# Altium project DevKitWRM1470-r1.2.PrjPcb
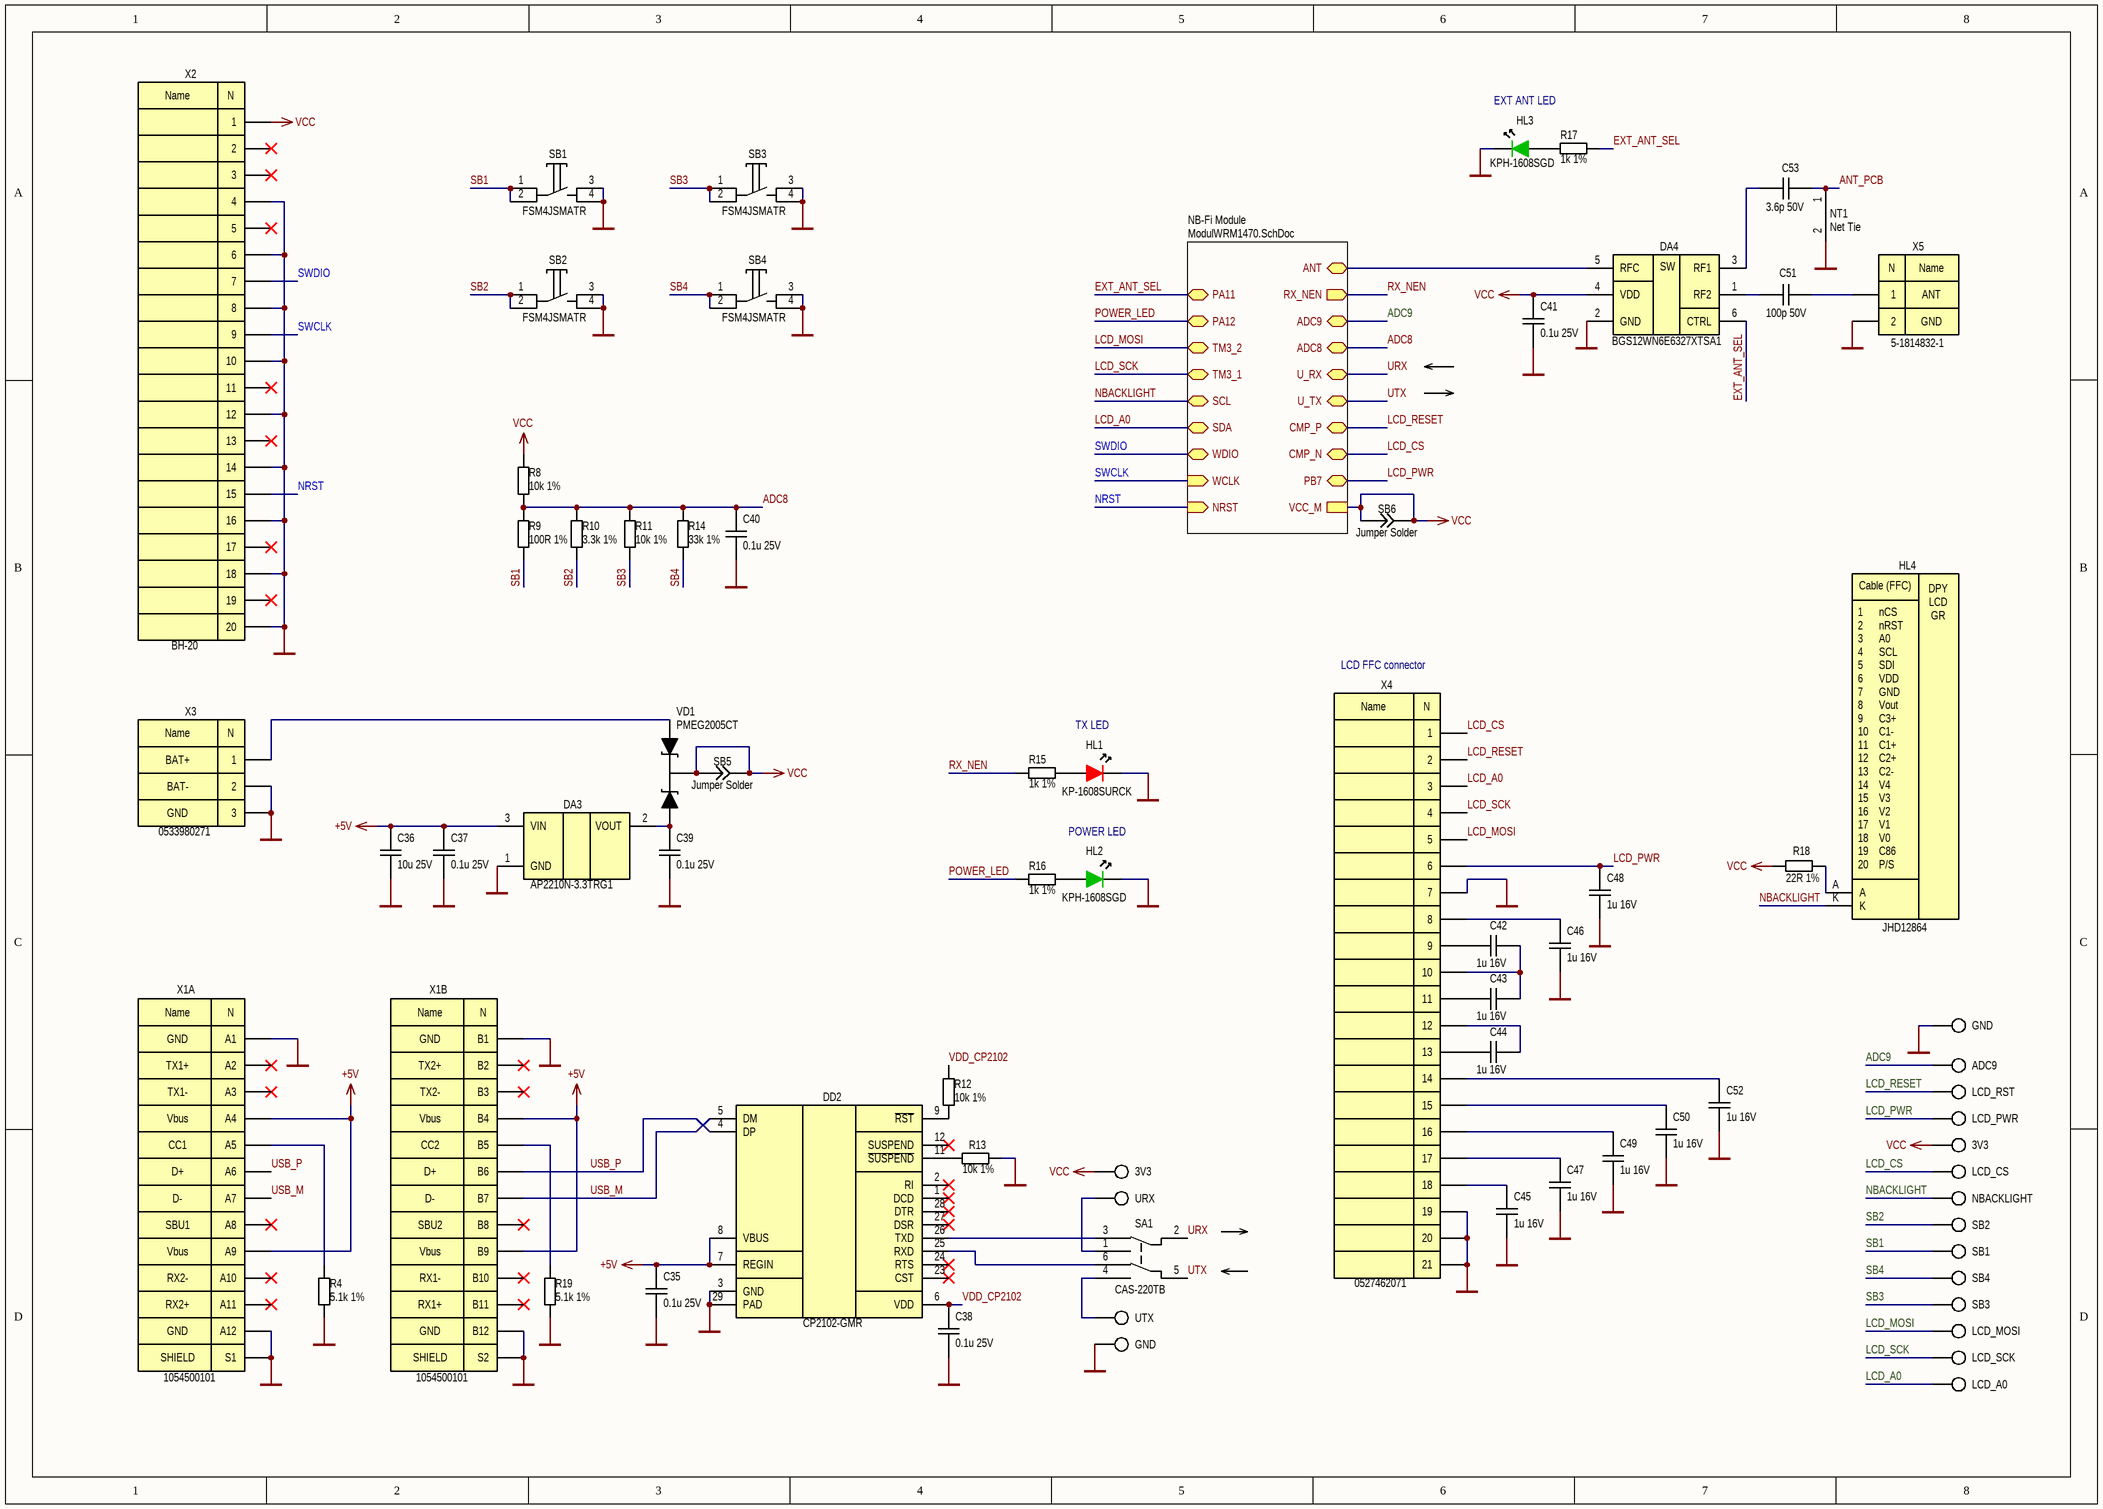
[diagram p0: DevKitWRM1470-r1.2.SchDoc]
2 sheets, 154 parts. Net scope: hierarchical (ports join the sheet entries above them; power ports are global).
Board file: DevKitWRM1470-r1.2.PcbDoc
Sheets:
  DevKitWRM1470-r1.2.SchDoc
    NB-Fi Module = ModulWRM1470.SchDoc

## Sheet DevKitWRM1470-r1.2.SchDoc
size A3; SheetNumber: 1; PageSetup: Record=PageOptions|CenterHorizontal=True|CenterVertical=True|PrintScale=0.52|XCorrection=1.00|YCorrection=1.00|PrintKind=1|BorderSize=5000000|LeftOffset=0|BottomOffset=0|Orientation=2|PaperLength=1000|PaperWidth=1000|Scale=100|PaperSource=7|PrintQuality=600|MediaType=1|DitherType=10|PaperKind=A4|PrintScaleMode=1

### Parts
C35  0.1u 25V  [C0402]
C36  10u 25V  [C0805]
C37  0.1u 25V  [C0402]
C38  0.1u 25V  [C0402]
C39  0.1u 25V  [C0402]
C40  0.1u 25V  [C0402]
C41  0.1u 25V  [C0402]
C42  1u 16V  [C0402]
C43  1u 16V  [C0402]
C44  1u 16V  [C0402]
C45  1u 16V  [C0402]
C46  1u 16V  [C0402]
C47  1u 16V  [C0402]
C48  1u 16V  [C0402]
C49  1u 16V  [C0402]
C50  1u 16V  [C0402]
C51  100p 50V  [C0402]
C52  1u 16V  [C0402]
C53  3.6p 50V  [C0402]
DA3  AP2210N-3.3TRG1  [SOT23-3L]
DA4  BGS12WN6E6327XTSA1  [6-XFDFN]
DD2  CP2102-GMR  [QFN28]
HL1  KP-1608SURCK  [LED0603_RED]
HL2  KPH-1608SGD  [LED0603_GREEN]
HL3  KPH-1608SGD  [LED0603_GREEN]
HL4  JHD12864  [JHD12864]
NT1  Net Tie  [NETTIE-5.0x4.0]  (net tie, no BOM)
R4  5.1k 1%  [R0402]
R8  10k 1%  [R0402]
R9  100R 1%  [R0402]
R10  3.3k 1%  [R0402]
R11  10k 1%  [R0402]
R12  10k 1%  [R0402]
R13  10k 1%  [R0402]
R14  33k 1%  [R0402]
R15  1k 1%  [R0402]
R16  1k 1%  [R0402]
R17  1k 1%  [R0402]
R18  22R 1%  [R0402]
R19  5.1k 1%  [R0402]
SA1  CAS-220TB  [CAS-220]
SB1  FSM4JSMATR  [FSM4JSMATR]
SB2  FSM4JSMATR  [FSM4JSMATR]
SB3  FSM4JSMATR  [FSM4JSMATR]
SB4  FSM4JSMATR  [FSM4JSMATR]
SB5  Jumper Solder  [SB0805]  (no BOM)
SB6  Jumper Solder  [SB0805]  (no BOM)
VD1  PMEG2005CT  [SOT23-3L]
X1  1054500101  [1054500101]  (parts A,B of 2)
X2  BH-20  [BH-20_PCB]
X3  0533980271  [0533980271_PCB]
X4  0527462071  [0527462071_PCB]
X5  5-1814832-1  [5-1814832-1]
XT24  3V3  [PAD-d0.9-x1.5-y1.5]  (no BOM)
XT25  URX  [PAD-d0.9-x1.5-y1.5]  (no BOM)
XT26  UTX  [PAD-d0.9-x1.5-y1.5]  (no BOM)
XT27  GND  [PAD-d0.9-x1.5-y1.5]  (no BOM)
XT28  GND  [PAD-d0.9-x1.5-y1.5]  (no BOM)
XT29  ADC9  [PAD-d0.9-x1.5-y1.5]  (no BOM)
XT30  LCD_RST  [PAD-d0.9-x1.5-y1.5]  (no BOM)
XT31  LCD_PWR  [PAD-d0.9-x1.5-y1.5]  (no BOM)
XT32  3V3  [PAD-d0.9-x1.5-y1.5]  (no BOM)
XT33  LCD_CS  [PAD-d0.9-x1.5-y1.5]  (no BOM)
XT34  NBACKLIGHT  [PAD-d0.9-x1.5-y1.5]  (no BOM)
XT35  SB2  [PAD-d0.9-x1.5-y1.5]  (no BOM)
XT36  SB1  [PAD-d0.9-x1.5-y1.5]  (no BOM)
XT37  SB4  [PAD-d0.9-x1.5-y1.5]  (no BOM)
XT38  SB3  [PAD-d0.9-x1.5-y1.5]  (no BOM)
XT39  LCD_MOSI  [PAD-d0.9-x1.5-y1.5]  (no BOM)
XT40  LCD_SCK  [PAD-d0.9-x1.5-y1.5]  (no BOM)
XT41  LCD_A0  [PAD-d0.9-x1.5-y1.5]  (no BOM)

### Sub-sheets
NB-Fi Module = ModulWRM1470.SchDoc: ADC8 (bidir), TM3_2 (bidir), ADC9 (bidir), TM3_1 (bidir), SCL (bidir), SDA (bidir), WDIO (bidir), WCLK (in), NRST (in), U_RX (bidir), U_TX (bidir), CMP_P (bidir), CMP_N (bidir), ANT (bidir), PA12 (bidir), PB7 (bidir), VCC_M, PA11 (bidir), RX_NEN (out)

### Nets
+5V: C35.2 C36.1 C37.2 DA3.3(VIN) DD2.7(REGIN) DD2.8(VBUS) X1.A4 X1.A9 X1.B4 X1.B9
GND: C35.1 C36.2 C37.1 C38.1 C39.1 C40.1 C41.1 C45.1 C46.1 C47.1 C48.1 C49.1 C50.1 C52.1 DA3.1(GND) DA4.2(GND) DD2.3(GND) DD2.29(PAD) HL1.2 HL2.2 HL3.2 NT1.2 R4.2 R13.1 R19.2 SB1.3 SB1.4 SB2.3 SB2.4 SB3.3 SB3.4 SB4.3 SB4.4 X1.A1 X1.A12 X1.B1 X1.B12 X1.S1 X1.S2 X2.4 X2.6 X2.8 X2.10 X2.12 X2.14 X2.16 X2.18 X2.20 X3.2 X3.3 X4.7 X4.19 X4.20 X4.21 X5.2 XT27.1 XT28.1
VCC: C41.2 DA4.4(VDD) R8.2 R18.2 SB5.1 SB5.2 SB6.1 SB6.2 VD1.3(K) X2.1 XT24.1 XT32.1 ; sheet NB-Fi Module/VCC_M  [project net VCC_M]
ADC8: C40.2 R8.1 R9.2 R10.2 R11.2 R14.2 ; sheet NB-Fi Module/ADC8
ADC9: XT29.1 ; sheet NB-Fi Module/ADC9
ANT_PCB: C53.2 NT1.1
EXT_ANT_SEL: DA4.6(CTRL) R17.1 ; sheet NB-Fi Module/PA11
LCD_A0: X4.3 XT41.1 ; sheet NB-Fi Module/SDA  [project net I2C1_SDA]
LCD_CS: X4.1 XT33.1 ; sheet NB-Fi Module/CMP_N  [project net COMP1_INM]
LCD_MOSI: X4.5 XT39.1 ; sheet NB-Fi Module/TM3_2
LCD_PWR: C48.2 X4.6 XT31.1 ; sheet NB-Fi Module/PB7
LCD_RESET: X4.2 XT30.1 ; sheet NB-Fi Module/CMP_P  [project net COMP1_INP]
LCD_SCK: X4.4 XT40.1 ; sheet NB-Fi Module/TM3_1
NBACKLIGHT: HL4.K XT34.1 ; sheet NB-Fi Module/SCL  [project net I2C1_SCL]
NRST: X2.15 ; sheet NB-Fi Module/NRST
POWER_LED: R16.1 ; sheet NB-Fi Module/PA12  [project net PA12]
RX_NEN: R15.1 ; sheet NB-Fi Module/RX_NEN
SB1: R9.1 SB1.1 SB1.2 XT36.1
SB2: R10.1 SB2.1 SB2.2 XT35.1
SB3: R11.1 SB3.1 SB3.2 XT38.1
SB4: R14.1 SB4.1 SB4.2 XT37.1
SWCLK: X2.9 ; sheet NB-Fi Module/WCLK
SWDIO: X2.7 ; sheet NB-Fi Module/WDIO
URX: SA1.2 ; sheet NB-Fi Module/U_RX  [project net LPUART1_RX]
USB_M: DD2.5(DM) X1.A7 X1.B7
USB_P: DD2.4(DP) X1.A6 X1.B6
UTX: SA1.5 ; sheet NB-Fi Module/U_TX  [project net LPUART1_TX]
VDD_CP2102: C38.2 DD2.6(VDD) R12.2
NetC33_2: DA4.5(RFC) ; sheet NB-Fi Module/ANT
NetC39_2: C39.2 DA3.2(VOUT) VD1.2(A2)
NetC42_1: C42.1 C43.1 X4.10
NetC42_2: C42.2 X4.9
NetC43_2: C43.2 X4.11
NetC44_1: C44.1 X4.12
NetC44_2: C44.2 X4.13
NetC45_2: C45.2 X4.18
NetC46_2: C46.2 X4.8
NetC47_2: C47.2 X4.17
NetC49_2: C49.2 X4.16
NetC50_2: C50.2 X4.15
NetC51_1: C51.1 DA4.1(RF2)
NetC51_2: C51.2 X5.1
NetC52_2: C52.2 X4.14
NetC53_1: C53.1 DA4.3(RF1)
NetDD2_9: DD2.9(~{RST}) R12.1
NetDD2_11: DD2.11(~{SUSPEND}) R13.2
NetDD2_25: DD2.25(RXD) SA1.6
NetDD2_26: DD2.26(TXD) SA1.3
NetHL1_1: HL1.1 R15.2
NetHL2_1: HL2.1 R16.2
NetHL3_1: HL3.1 R17.2
NetHL4_A: HL4.A R18.1
NetR4_1: R4.1 X1.A5
NetR19_1: R19.1 X1.B5
NetSA1_1: SA1.1 XT25.1
NetSA1_4: SA1.4 XT26.1
NetVD1_1: VD1.1(A1) X3.1

Not connected (* = marked no-connect by the designer): DD2 1(DCD)* 2(RI)* 12(SUSPEND)* 23(CST)* 24(RTS)* 27(DSR)* 28(DTR)*; X1 A2* A3* A8* A10* A11* B2* B3* B8* B10* B11*; X2 2* 3* 5* 11* 13* 17* 19*

### Notes on the sheet
- EXT ANT LED
- LCD FFC connector
- BAT+
- BAT-
- TX LED
- GND
- POWER LED
- (in symbol 5-1814832-1) N; Name; ANT; GND
- (in symbol 0527462071) Name; N
- (in symbol 0533980271) Name; N
- (in symbol 1054500101, part A) Name; N; GND; TX1+; TX1-; Vbus; CC1; D+; D-; SBU1; RX2-; RX2+; SHIELD
- (in symbol 1054500101, part B) Name; N; GND; TX2+; TX2-; Vbus; CC2; D+; D-; SBU2; RX1-; RX1+; SHIELD
- (in symbol BGS12WN6E6327XTSA1) SW
- (in symbol BH-20) Name; N
- (in symbol JHD12864) Cable (FFC); 1; nCS; DPY / LCD / GR; 2; nRST; 3; A0; 4; SCL; 5; SDI; 6; VDD; 7; GND; 8; Vout; 9; C3+; 10; C1-; 11; C1+; 12; C2+; 13; C2-; 14; V4; 15; V3; 16; V2; 17; V1; 18; V0; 19; C86; 20; P/S

### Library data of the parts
C35 C37-C41 = CC0402KRX7R8BB104: CAP CER 0.1UF 25V X7R 0402; PartNumber: CC0402KRX7R8BB104
C36 = CL21A106KAFN3NE: CAP CER 10UF 25V X5R 0805; PartNumber: CL21A106KAFN3NE
C42-C50 C52 = CC0402KRX5R7BB105: CAP CER 1UF 16V X5R 0402; PartNumber: CC0402KRX5R7BB105
C51 = CC0402JRNPO9BN101: CAP CER 100PF 50V C0G/NPO 0402; PartNumber: CC0402JRNPO9BN101
C53 = CC0402BRNPO9BN3R6: CAP CER 3.6PF 50V NPO 0402; PartNumber: CC0402BRNPO9BN3R6
DA3 = AP2210N-3.3TRG1: IC REG LINEAR 3.3V 300MA SOT23-3; PartNumber: AP2210N-3.3TRG1
DA4 = BGS12WN6E6327XTSA1: RF Switch IC WLAN SPDT 50Ohm PG-TSNP-6-10; PartNumber: BGS12WN6E6327XTSA1
DD2 = CP2102-GMR: IC USB-TO-UART BRIDGE 28VQFN; PartNumber: CP2102-GMR
HL1 = KP-1608SURCK: LED Red 0603 1.95V Forward voltage typ.; PartNumber: KP-1608SURCK
HL2 HL3 = KPH-1608SGD: Led Green 0603 2.2V Forward voltage typ.; PartNumber: KPH-1608SGD
HL4 = JHD12864: Display Graphical with LED-backlight; PartNumber: JHD12864
NT1 = NT-1: PCB Net Tie
R4 R19 = RC0402FR-075K1L: RES SMD 5.1K OHM 1% 1/16W 0402; PartNumber: RC0402FR-075K1L
R8 R11-R13 = RC0402FR-0710KL: RES SMD 10K OHM 1% 1/16W 0402; PartNumber: RC0402FR-0710KL
R9 = RC0402FR-07100RL: RES SMD 100 OHM 1% 1/16W 0402; PartNumber: RC0402FR-07100RL
R10 = RC0402FR-073K3L: RES SMD 3.3K OHM 1% 1/16W 0402; PartNumber: RC0402FR-073K3L
R14 = RC0402FR-0733KL: RES SMD 33K OHM 1% 1/16W 0402; PartNumber: RC0402FR-0733KL
R15-R17 = RC0402FR-071KL: RES SMD 1K OHM 1% 1/16W 0402; PartNumber: RC0402FR-071KL
R18 = RC0402FR-0722RL: RES SMD 22 OHM 1% 1/16W 0402; PartNumber: RC0402FR-0722RL
SA1 = CAS-220TB: SWITCH SLIDE DPDT 100MA 6V; PartNumber: CAS-220TB
SB1-SB4 = FSM4JSMATR: SWITCH TACTILE SPST-NO 0.05A 24V; PartNumber: FSM4JSMATR
SB5 SB6 = JS_0805: Jumper Solder 0805; Value: *
VD1 = PMEG2005CT: DIODE ARRAY SCHOTTKY 20V SOT23; PartNumber: PMEG2005CT
X1 = 1054500101: CONN RCP USB3.1 TYPEC 24P SMD RA; PartNumber: 1054500101; ComponentLink1Description: Datasheet; ComponentLink1URL: https://www.molex.com/pdm_docs/ps/PS-105448-001.pdf; ComponentLink2Description: Drawing; ComponentLink2URL: https://www.molex.com/pdm_docs/sd/1054500101_sd.pdf
X2 = BH-20: CONN MALE 20POS 2.54 (IDC-20MS); PartNumber: BH-20
X3 = 0533980271: CONN HEADER SMD 2POS 1.25MM; PartNumber: 0533980271
X4 = 0527462071: CONN FFC BOTTOM 20POS 0.50MM R/A; PartNumber: 0527462071
X5 = 5-1814832-1: CONN SMA JACK STR 50 OHM PCB; PartNumber: 5-1814832-1
XT24-XT41 = PIN

## Sheet ModulWRM1470.SchDoc: Радиомодуль NB-Fi
size 420 x 297 mm; CompanyName: Телематические решения; Address1: Address1; Address2: Address2; Address3: Address3; Address4: Address4; DocumentNumber: XXXX.012345.007Э3; SheetNumber: 1; SheetTotal: 1; Scale: 1:1; Title2str: WRM1470-r1.0; DocumentType: Схема электрическая принципиальная; FirstReferrence: АБВГ.123456.001
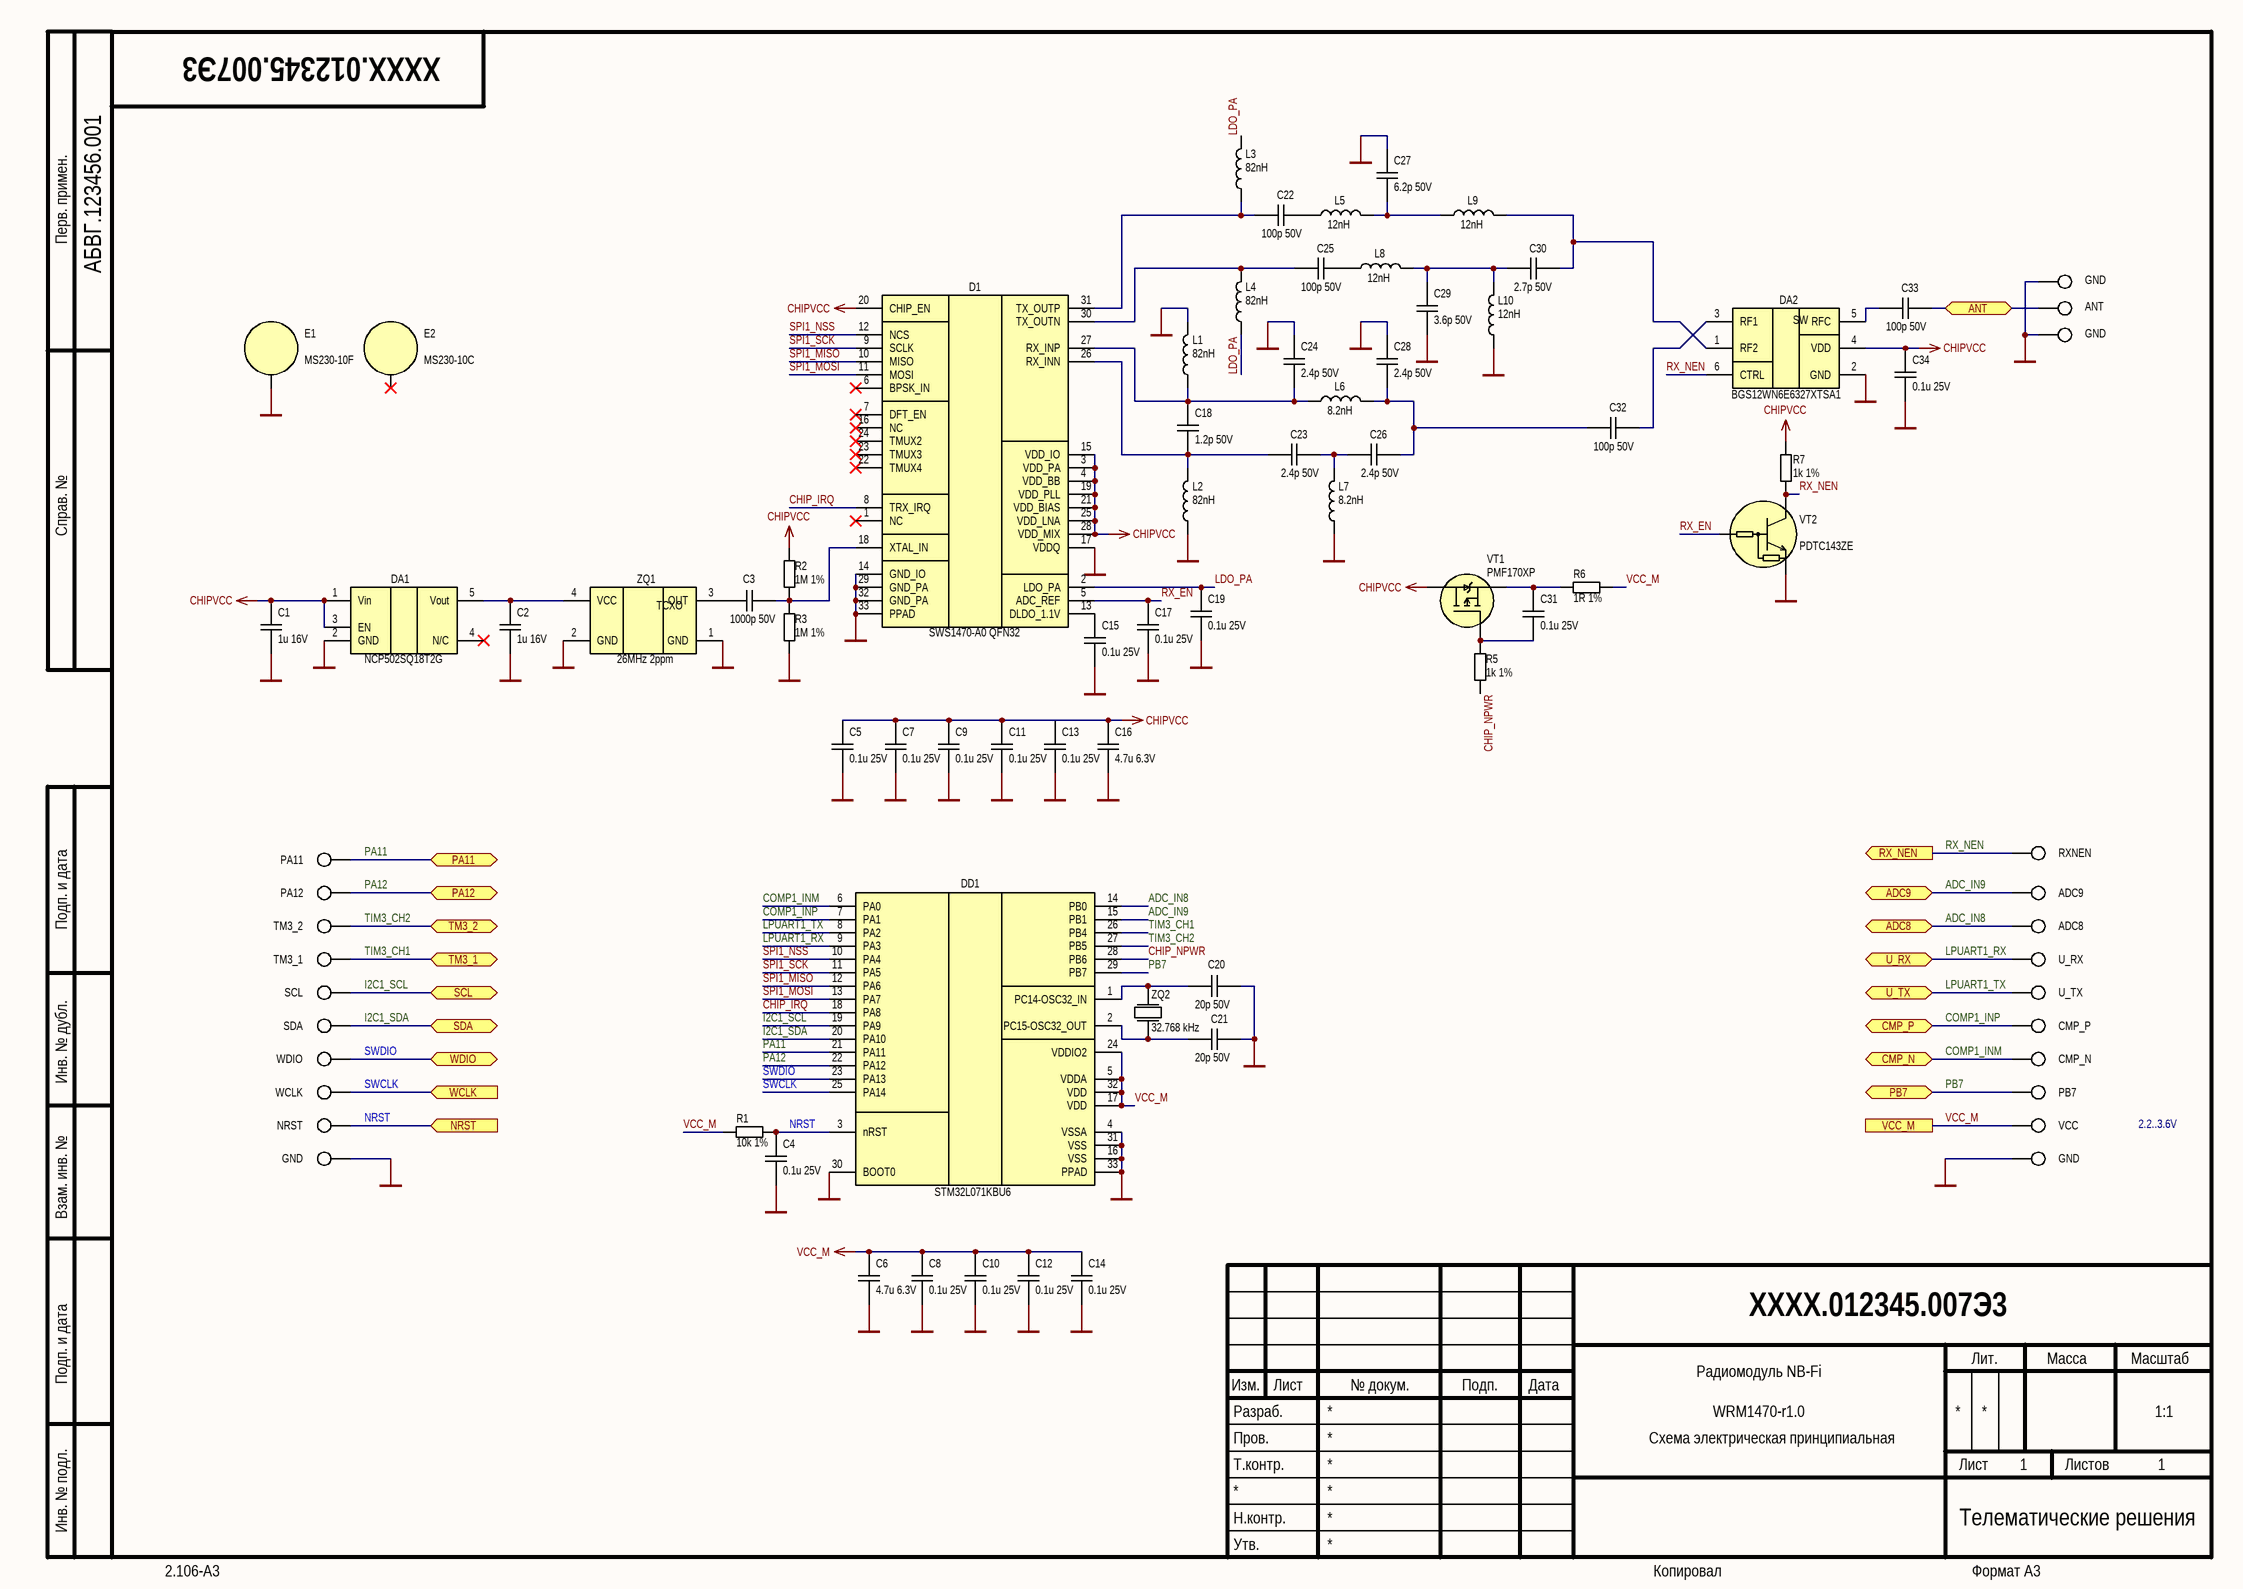
[diagram p1: ModulWRM1470.SchDoc]

### Parts
C1  1u 16V  [C0402]
C2  1u 16V  [C0402]
C3  1000p 50V  [C0402]
C4  0.1u 25V  [C0402]
C5  0.1u 25V  [C0402]
C6  4.7u 6.3V  [C0402]
C7  0.1u 25V  [C0402]
C8  0.1u 25V  [C0402]
C9  0.1u 25V  [C0402]
C10  0.1u 25V  [C0402]
C11  0.1u 25V  [C0402]
C12  0.1u 25V  [C0402]
C13  0.1u 25V  [C0402]
C14  0.1u 25V  [C0402]
C15  0.1u 25V  [C0402]
C16  4.7u 6.3V  [C0402]
C17  0.1u 25V  [C0402]
C18  1.2p 50V  [C0402]
C19  0.1u 25V  [C0402]
C20  20p 50V  [C0402]
C21  20p 50V  [C0402]
C22  100p 50V  [C0402]
C23  2.4p 50V  [C0402]
C24  2.4p 50V  [C0402]
C25  100p 50V  [C0402]
C26  2.4p 50V  [C0402]
C27  6.2p 50V  [C0402]
C28  2.4p 50V  [C0402]
C29  3.6p 50V  [C0402]
C30  2.7p 50V  [C0402]
C31  0.1u 25V  [C0402]
C32  100p 50V  [C0402]
C33  100p 50V  [C0402]
C34  0.1u 25V  [C0402]
D1  SWS1470-A0 QFN32  [QFN32]
DA1  NCP502SQ18T2G  [SOT323-5]
DA2  BGS12WN6E6327XTSA1  [6-XFDFN]
DD1  STM32L071KBU6  [UFQFPN32]
E1  MS230-10F  [MS230-10F]
E2  MS230-10C  [MS230-10C]
L1  82nH  [L0402_LQW]
L2  82nH  [L0402_LQW]
L3  82nH  [L0402_LQW]
L4  82nH  [L0402_LQW]
L5  12nH  [L0402_LQW]
L6  8.2nH  [L0402_LQW]
L7  8.2nH  [L0402_LQW]
L8  12nH  [L0402_LQW]
L9  12nH  [L0402_LQW]
L10  12nH  [L0402_LQW]
R1  10k 1%  [R0402]
R2  1M 1%  [R0402]
R3  1M 1%  [R0402]
R5  1k 1%  [R0402]
R6  1R 1%  [R0402]
R7  1k 1%  [R0402]
VT1  PMF170XP  [SOT323]
VT2  PDTC143ZE  [SOT416]
XT1  PA11  [PAD-d0.6-x1.1-y1.2]  (no BOM)
XT2  PA12  [PAD-d0.6-x1.1-y1.2]  (no BOM)
XT3  TM3_2  [PAD-d0.6-x1.1-y1.2]  (no BOM)
XT4  TM3_1  [PAD-d0.6-x1.1-y1.2]  (no BOM)
XT5  SCL  [PAD-d0.6-x1.1-y1.2]  (no BOM)
XT6  SDA  [PAD-d0.6-x1.1-y1.2]  (no BOM)
XT7  WDIO  [PAD-d0.6-x1.1-y1.2]  (no BOM)
XT8  WCLK  [PAD-d0.6-x1.1-y1.2]  (no BOM)
XT9  NRST  [PAD-d0.6-x1.1-y1.2]  (no BOM)
XT10  GND  [PAD-d0.6-x1.1-y1.2]  (no BOM)
XT11  GND  [PAD-d0.6-x1.1-y1.2]  (no BOM)
XT12  VCC  [PAD-d0.6-x1.1-y1.2]  (no BOM)
XT13  PB7  [PAD-d0.6-x1.1-y1.2]  (no BOM)
XT14  CMP_N  [PAD-d0.6-x1.1-y1.2]  (no BOM)
XT15  CMP_P  [PAD-d0.6-x1.1-y1.2]  (no BOM)
XT16  U_TX  [PAD-d0.6-x1.1-y1.2]  (no BOM)
XT17  U_RX  [PAD-d0.6-x1.1-y1.2]  (no BOM)
XT18  ADC8  [PAD-d0.6-x1.1-y1.2]  (no BOM)
XT19  ADC9  [PAD-d0.6-x1.1-y1.2]  (no BOM)
XT20  RXNEN  [PAD-d0.6-x1.1-y1.2]  (no BOM)
XT21  GND  [PAD-d0.6-x1.1-y1.2]  (no BOM)
XT22  ANT  [PAD-d0.6-x1.1-y1.2]  (no BOM)
XT23  GND  [PAD-d0.6-x1.1-y1.2]  (no BOM)
ZQ1  26MHz 2ppm  [QSMD2.0x1.6x0.7]
ZQ2  32.768 kHz  [QSMD3.2X1.5X0.8]

### Ports
ADC8 (bidir), ADC9 (bidir), ANT (bidir), CMP_N (bidir), CMP_P (bidir), NRST (in), PA11 (bidir), PA12 (bidir), PB7 (bidir), RX_NEN (out), SCL (bidir), SDA (bidir), TM3_1 (bidir), TM3_2 (bidir), U_RX (bidir), U_TX (bidir), VCC_M, WCLK (in), WDIO (bidir)

### Nets
CHIPVCC: C1.2 C5.2 C7.2 C9.2 C11.2 C13.2 C16.2 C34.2 D1.3(VDD_PA) D1.4(VDD_BB) D1.15(VDD_IO) D1.19(VDD_PLL) D1.20(CHIP_EN) D1.21(VDD_BIAS) D1.25(VDD_LNA) D1.28(VDD_MIX) DA1.1(Vin) DA1.3(EN) DA2.4(VDD) R2.2 R7.2 VT1.3(D)
GND: C1.1 C2.1 C4.2 C5.1 C6.2 C7.1 C8.2 C9.1 C10.2 C11.1 C12.2 C13.1 C14.2 C15.1 C16.1 C17.1 C19.1 C20.2 C21.2 C24.1 C27.1 C28.1 C29.2 C34.1 D1.14(GND_IO) D1.17(VDDQ) D1.29(GND_PA) D1.32(GND_PA) D1.33(PPAD) DA1.2(GND) DA2.2(GND) DD1.4(VSSA) DD1.16(VSS) DD1.30(BOOT0) DD1.31(VSS) DD1.33(PPAD) E1.1(SHIELD) L1.2 L2.1 L7.1 L10.1 R3.1 VT2.2 XT10.1 XT11.1 XT21.1 XT23.1 ZQ1.1(GND) ZQ1.2(GND)
VCC_M: C6.1 C8.1 C10.1 C12.1 C14.1 DD1.5(VDDA) DD1.17(VDD) DD1.24(VDDIO2) DD1.32(VDD) R1.1 R6.1 XT12.1 ; port VCC_M
ADC_IN8: DD1.14(PB0) XT18.1 ; port ADC8  [project net ADC8]
ADC_IN9: DD1.15(PB1) XT19.1 ; port ADC9  [project net ADC9]
CHIP_IRQ: D1.8(TRX_IRQ) DD1.18(PA8)
CHIP_NPWR: DD1.28(PB6) R5.1
COMP1_INM: DD1.6(PA0) XT14.1 ; port CMP_N
COMP1_INP: DD1.7(PA1) XT15.1 ; port CMP_P
I2C1_SCL: DD1.19(PA9) XT5.1 ; port SCL
I2C1_SDA: DD1.20(PA10) XT6.1 ; port SDA
LDO_PA: C19.2 D1.2(LDO_PA) L3.2 L4.1
LPUART1_RX: DD1.9(PA3) XT17.1 ; port U_RX
LPUART1_TX: DD1.8(PA2) XT16.1 ; port U_TX
NRST: C4.1 DD1.3(nRST) R1.2 XT9.1 ; port NRST
PA11: DD1.21(PA11) XT1.1 ; port PA11  [project net EXT_ANT_SEL]
PA12: DD1.22(PA12) XT2.1 ; port PA12
PB7: DD1.29(PB7) XT13.1 ; port PB7  [project net LCD_PWR]
RX_EN: C17.2 D1.5(ADC_REF) VT2.1
RX_NEN: DA2.6(CTRL) R7.1 VT2.3 XT20.1 ; port RX_NEN
SPI1_MISO: D1.10(MISO) DD1.12(PA6)
SPI1_MOSI: D1.11(MOSI) DD1.13(PA7)
SPI1_NSS: D1.12(NCS) DD1.10(PA4)
SPI1_SCK: D1.9(SCLK) DD1.11(PA5)
SWCLK: DD1.25(PA14) XT8.1 ; port WCLK
SWDIO: DD1.23(PA13) XT7.1 ; port WDIO
TIM3_CH1: DD1.26(PB4) XT4.1 ; port TM3_1  [project net LCD_SCK]
TIM3_CH2: DD1.27(PB5) XT3.1 ; port TM3_2  [project net LCD_MOSI]
NetC2_2: C2.2 DA1.5(Vout) ZQ1.4(VCC)
NetC3_1: C3.1 ZQ1.3(OUT)
NetC3_2: C3.2 D1.18(XTAL_IN) R2.1 R3.2
NetC15_2: C15.2 D1.13(DLDO_1.1V)
NetC18_1: C18.1 C24.2 D1.27(RX_INP) L1.1 L6.1
NetC18_2: C18.2 C23.1 D1.26(RX_INN) L2.2
NetC20_1: C20.1 DD1.1(PC14-OSC32_IN) ZQ2.1
NetC21_1: C21.1 DD1.2(PC15-OSC32_OUT) ZQ2.3
NetC22_1: C22.1 D1.31(TX_OUTP) L3.1
NetC22_2: C22.2 L5.1
NetC23_2: C23.2 C26.1 L7.2
NetC25_1: C25.1 D1.30(TX_OUTN) L4.2
NetC25_2: C25.2 L8.1
NetC26_2: C26.2 C28.2 C32.1 L6.2
NetC27_2: C27.2 L5.2 L9.1
NetC29_1: C29.1 C30.1 L8.2 L10.2
NetC30_2: C30.2 DA2.1(RF2) L9.2
NetC31_1: C31.1 R5.2 VT1.1(G)
NetC31_2: C31.2 R6.2 VT1.2(S)
NetC32_2: C32.2 DA2.3(RF1)
NetC33_1: C33.1 DA2.5(RFC)
NetC33_2: C33.2 XT22.1 ; port ANT

Not connected (* = marked no-connect by the designer): D1 1(NC)* 6(BPSK_IN)* 7(DFT_EN)* 16(NC)* 22(TMUX4)* 23(TMUX3)* 24(TMUX2)*; DA1 4(N/C)*; E2 1(SHIELD)*

### Notes on the sheet
- 2.2..3.6V
- Перв. примен.
- Справ. №
- Подп. и дата
- Инв. № дубл.
- Взам. инв. №
- Разраб.
- Изм.
- Лист
- № докум.
- Подп.
- Дата
- Лит.
- Масса
- Масштаб
- Пров.
- Т.контр.
- Листов
- Инв. № подл.
- Утв.
- Н.контр.
- 2.106-A3
- Копировал
- Формат А3
- (in symbol BGS12WN6E6327XTSA1) SW
- (in symbol NT2016SA-26.000000MHZ-NBG2) TCXO

### Library data of the parts
C1 C2 = CC0402KRX5R7BB105: CAP CER 1UF 16V X5R 0402; PartNumber: CC0402KRX5R7BB105
C3 = CC0402JRX7R9BB102: CAP CER 1000PF 50V X7R 0402; PartNumber: CC0402JRX7R9BB102
C4 C5 C7-C15 C17 C19 C31 C34 = CC0402KRX7R8BB104: CAP CER 0.1UF 25V X7R 0402; PartNumber: CC0402KRX7R8BB104
C6 C16 = CC0402KRX5R5BB475: CAP CER 4.7UF 6.3V X5R 0402; PartNumber: CC0402KRX5R5BB475
C18 = CC0402BRNPO9BN1R2: CAP CER 1.2PF 50V C0G/NPO 0402; PartNumber: CC0402BRNPO9BN1R2
C20 C21 = CC0402JRNPO9BN200: CAP CER 20PF 50V C0G/NPO 0402; PartNumber: CC0402JRNPO9BN200
C22 C25 C32 C33 = CC0402JRNPO9BN101: CAP CER 100PF 50V C0G/NPO 0402; PartNumber: CC0402JRNPO9BN101
C23 C24 C26 C28 = CC0402BRNPO9BN2R4: CAP CER 2.4PF 50V NPO 0402; PartNumber: CC0402BRNPO9BN2R4
C27 = CC0402CRNPO9BN6R2: CAP CER 6.2PF 50V NPO 0402; PartNumber: CC0402CRNPO9BN6R2
C29 = CC0402BRNPO9BN3R6: CAP CER 3.6PF 50V NPO 0402; PartNumber: CC0402BRNPO9BN3R6
C30 = CC0402BRNPO9BN2R7: CAP CER 2.7PF 50V C0G/NPO 0402; PartNumber: CC0402BRNPO9BN2R7
D1 = SWS1470-A0 QFN32: Waviot NB-Fi RF Transceiver QFN32; PartNumber: SWS1470-A0 QFN32
DA1 = NCP502SQ18T2G: IC REG LINEAR 1.8V 80MA SC88A; PartNumber: NCP502SQ18T2G
DA2 = BGS12WN6E6327XTSA1: as DA4 on sheet DevKitWRM1470-r1.2; PartNumber: BGS12WN6E6327XTSA1
DD1 = STM32L071KBU6: ARM® Cortex®-M0+ STM32L0 Microcontroller IC 32-Bit 32MHz 128KB (128K x 8) FLASH 32-UFQFPN (5x5); PartNumber: STM32L071KBU6
E1 = MS230-10F: RF SHLD FRAME 0.461"X0.906" SLDR; PartNumber: MS230-10F
E2 = MS230-10C: RF SHIELD 0.461"X0.906" SNAP FIT; PartNumber: MS230-10C
L1-L4 = LQW15AN82NG00D: FIXED IND 82NH 130MA 2.24 OHM; PartNumber: LQW15AN82NG00D
L5 L8-L10 = LQW15AN12NG00D: FIXED IND 12NH 500MA 140 MOHM; PartNumber: LQW15AN12NG00D
L6 L7 = LQW15AN8N2G00D: FIXED IND 8.2NH 540MA 140 MOHM; PartNumber: LQW15AN8N2G00D
R1 = RC0402FR-0710KL: RES SMD 10K OHM 1% 1/16W 0402; PartNumber: RC0402FR-0710KL
R2 R3 = RC0402FR-071ML: RES SMD 1M OHM 1% 1/16W 0402; PartNumber: RC0402FR-071ML
R5 R7 = RC0402FR-071KL: RES SMD 1K OHM 1% 1/16W 0402; PartNumber: RC0402FR-071KL
R6 = RC0402FR-071RL: RES SMD 1 OHM 1% 1/16W 0402; PartNumber: RC0402FR-071RL
VT1 = PMF170XP: MOSFET P-CH 20V 1A SOT323; PartNumber: PMF170XP
VT2 = PDTC143ZE: SMALL SIGNAL BIPOLAR TRANSISTOR; PartNumber: PDTC143ZE
XT1-XT23 = PIN
ZQ1 = NT2016SA-26.000000MHZ-NBG2: TCXO Oscillator 4-pin; PartNumber: NT2016SA-26.000000MHZ-NBG2
ZQ2 = NX3215SA-32.768K-EXS00A: CRYSTAL 32.768KHZ 12.5PF SMD; PartNumber: NX3215SA-32.768K-EXS00A

## Nets that join several sheets
GND: DevKitWRM1470-r1.2 (57 pins), ModulWRM1470 (49 pins)
VCC_M: DevKitWRM1470-r1.2 (12 pins), ModulWRM1470 (12 pins)
ADC8: DevKitWRM1470-r1.2 (6 pins), ModulWRM1470 (DD1.14 XT18.1)
ADC9: DevKitWRM1470-r1.2 (XT29.1), ModulWRM1470 (DD1.15 XT19.1)
COMP1_INM: DevKitWRM1470-r1.2 (X4.1 XT33.1), ModulWRM1470 (DD1.6 XT14.1)
COMP1_INP: DevKitWRM1470-r1.2 (X4.2 XT30.1), ModulWRM1470 (DD1.7 XT15.1)
EXT_ANT_SEL: DevKitWRM1470-r1.2 (DA4.6 R17.1), ModulWRM1470 (DD1.21 XT1.1)
I2C1_SCL: DevKitWRM1470-r1.2 (HL4.K XT34.1), ModulWRM1470 (DD1.19 XT5.1)
I2C1_SDA: DevKitWRM1470-r1.2 (X4.3 XT41.1), ModulWRM1470 (DD1.20 XT6.1)
LCD_MOSI: DevKitWRM1470-r1.2 (X4.5 XT39.1), ModulWRM1470 (DD1.27 XT3.1)
LCD_PWR: DevKitWRM1470-r1.2 (C48.2 X4.6 XT31.1), ModulWRM1470 (DD1.29 XT13.1)
LCD_SCK: DevKitWRM1470-r1.2 (X4.4 XT40.1), ModulWRM1470 (DD1.26 XT4.1)
LPUART1_RX: DevKitWRM1470-r1.2 (SA1.2), ModulWRM1470 (DD1.9 XT17.1)
LPUART1_TX: DevKitWRM1470-r1.2 (SA1.5), ModulWRM1470 (DD1.8 XT16.1)
NetC33_2: DevKitWRM1470-r1.2 (DA4.5), ModulWRM1470 (C33.2 XT22.1)
NRST: DevKitWRM1470-r1.2 (X2.15), ModulWRM1470 (C4.1 DD1.3 R1.2 XT9.1)
PA12: DevKitWRM1470-r1.2 (R16.1), ModulWRM1470 (DD1.22 XT2.1)
RX_NEN: DevKitWRM1470-r1.2 (R15.1), ModulWRM1470 (DA2.6 R7.1 VT2.3 XT20.1)
SWCLK: DevKitWRM1470-r1.2 (X2.9), ModulWRM1470 (DD1.25 XT8.1)
SWDIO: DevKitWRM1470-r1.2 (X2.7), ModulWRM1470 (DD1.23 XT7.1)

## Assembly variants
Main: not fitted XT1 XT2 XT3 XT4 XT5 XT6 XT7 XT8 XT9 XT10 XT11 XT12 XT13 XT14 XT15 XT16 XT17 XT18 XT19 XT20 XT21 XT22 XT23 XT24 XT25 XT26 XT27 XT28 XT29 XT30 XT31 XT32 XT33 XT34 XT35 XT36 XT37 XT38 XT39 XT40 XT41